# Altium schematic sheet STM32_MCU.SchDoc
size A4; SheetNumber: 3; SheetTotal: 5
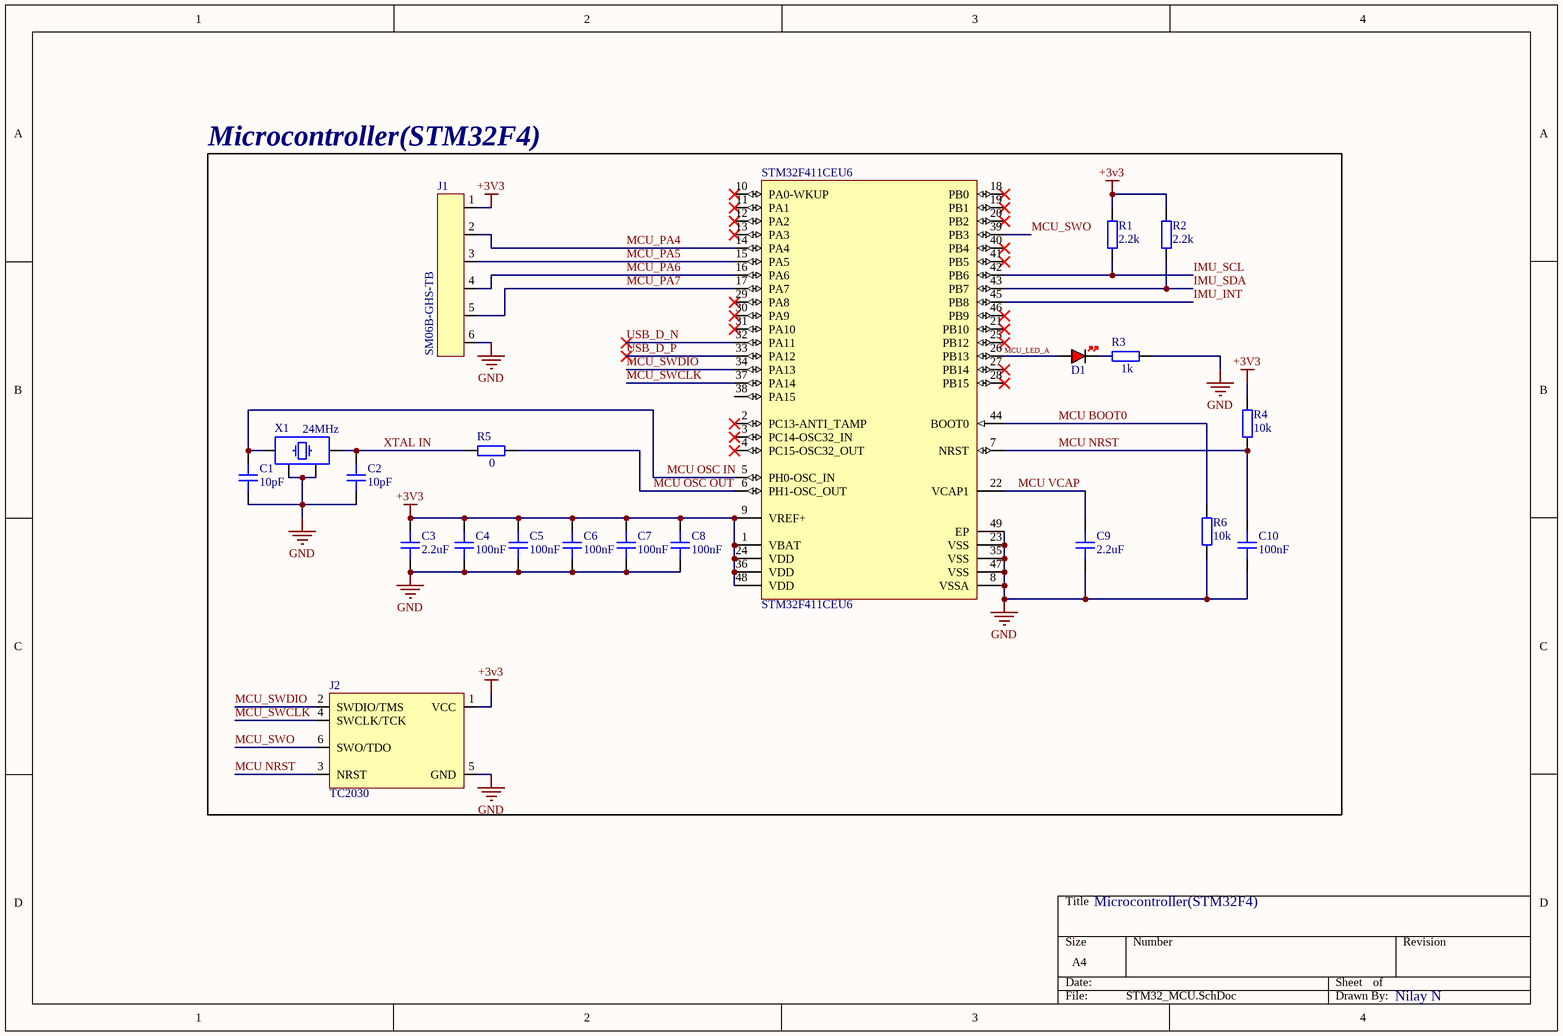
[diagram p0: STM32_MCU.SchDoc]

## Parts
C1  10pF  [CAP_0402]
C2  10pF  [CAP_0402]
C3  2.2uF  [CAP_0603]
C4  100nF  [CAP_0402]
C5  100nF  [CAP_0402]
C6  100nF  [CAP_0402]
C7  100nF  [CAP_0402]
C8  100nF  [CAP_0402]
C9  2.2uF  [CAP_0402]
C10  100nF  [CAP_0402]
D1  RED  [LED_0402_RED]  (value not drawn)
J1  SM06B-GHS-TB  [SM06B-GHS-TB]
J2  TC2030  [TC2030-FP]  (no BOM)
R1  2.2k  [RES_0402]
R2  2.2k  [RES_0402]
R3  1k  [RES_0402]
R4  10k  [RES_0402]
R5  0  [RES_0402]
R6  10k  [RES_0402]
STM32F411CEU6  STM32F411CEU6  [STM-UFQFPN48_L]
X1  24MHz  [XTAL_3225]

## Blocks framed on the sheet
Microcontroller(STM32F4): C1-C10 D1 J1 J2 R1-R6 STM32F411CEU6 X1

## Nets
+3V3: C3.2 C4.2 C5.2 C6.2 C7.2 C8.2 J1.1 J2.1(VCC) R1.2 R2.2 R4.2 STM32F411CEU6.1(VBAT) STM32F411CEU6.9(VREF+) STM32F411CEU6.24(VDD) STM32F411CEU6.36(VDD) STM32F411CEU6.48(VDD)
GND: C1.1 C2.1 C3.1 C4.1 C5.1 C6.1 C7.1 C8.1 C9.1 C10.1 J1.6 J2.5(GND) R3.1 R6.1 STM32F411CEU6.8(VSSA) STM32F411CEU6.23(VSS) STM32F411CEU6.35(VSS) STM32F411CEU6.47(VSS) STM32F411CEU6.49(EP) X1.2 X1.4
IMU_INT: STM32F411CEU6.45(PB8)
IMU_SCL: R1.1 STM32F411CEU6.42(PB6)
IMU_SDA: R2.1 STM32F411CEU6.43(PB7)
MCU BOOT0: R6.2 STM32F411CEU6.44(BOOT0)
MCU NRST: C10.2 J2.3(NRST) R4.1 STM32F411CEU6.7(NRST)
MCU OSC IN: C1.2 STM32F411CEU6.5(PH0-OSC_IN) X1.1
MCU OSC OUT: R5.2 STM32F411CEU6.6(PH1-OSC_OUT)
MCU VCAP: C9.2 STM32F411CEU6.22(VCAP1)
MCU_LED_A: D1.A STM32F411CEU6.26(PB13)
MCU_PA4: J1.2 STM32F411CEU6.14(PA4)
MCU_PA5: J1.3 STM32F411CEU6.15(PA5)
MCU_PA6: J1.4 STM32F411CEU6.16(PA6)
MCU_PA7: J1.5 STM32F411CEU6.17(PA7)
MCU_SWCLK: J2.4(SWCLK/TCK) STM32F411CEU6.37(PA14)
MCU_SWDIO: J2.2(SWDIO/TMS) STM32F411CEU6.34(PA13)
MCU_SWO: J2.6(SWO/TDO) STM32F411CEU6.39(PB3)
USB_D_N: STM32F411CEU6.32(PA11)
USB_D_P: STM32F411CEU6.33(PA12)
XTAL IN: C2.2 R5.1 X1.3
NetD1_K: D1.K R3.2

Not connected (* = marked no-connect by the designer): STM32F411CEU6 2(PC13-ANTI_TAMP)* 3(PC14-OSC32_IN)* 4(PC15-OSC32_OUT)* 10(PA0-WKUP)* 11(PA1)* 12(PA2)* 13(PA3)* 18(PB0)* 19(PB1)* 20(PB2)* 21(PB10)* 25(PB12)* 27(PB14)* 28(PB15)* 29(PA8)* 30(PA9)* 31(PA10)* 38(PA15) 40(PB4)* 41(PB5)* 46(PB9)*

## Notes on the sheet
- Microcontroller(STM32F4)
- Nilay N

## Library data of the parts
C1 C2 C4-C10 = CAP_0402: Capacitor SMD 0402; Manufacturer: *; Manufacturer Part Number: *; Distributor Link: *; LCSC: *; Rating: *; Dielectric: *
C3 = CAP_0603: Capacitor SMD 0603; Manufacturer: *; Manufacturer Part Number: *; Distributor Link: *; LCSC: *; Rating: *; Dielectric: *
D1 = LED_0402_RED: LED 0402 RED SMD
J1 = SM06B-GHS-TB: Header Connector 6 Position 1.25MM Pitch SMD Horizontal JST GH; Manufacturer: JST; Manufacturer Part Number: SM06B-GHS-TB
J2 = TC2030: Tag-Connect No-Solder SWD Debug Connector DO NOT PLACE; Manufacturer: Tag-Connect; Manufacturer Part Number: TC2030
R1-R6 = RES_0402: Resistor SMD 0402; Manufacturer: *; Manufacturer Part Number: *; Distributor Link: *; LCSC: *
STM32F411CEU6 = CMP-0243-00165-1: ARM Cortex-M4 32-bit MCU+FPU, 512 KB Flash, 128 KB RAM, 36 I/Os, 48-Pin UFQFPN, -40 to 85 degC, Tray; Operating Frequency(F) (Processor speed) (MHz): 100; FLASH Size (Prog) (kB): 512; Internal RAM Size (kB): 128; I/Os (High Current): 36; Supply Voltage(Vcc) min (V): 1.7; Package Reference: 48-Pin Ultra Thin Fine Pitch Quad Flat No-Lead, 7 x 7 x 0.6 mm Body, 0.5 mm Pitch, Exposed Pad; ComponentLink1Description: Manufacturer URL; ComponentLink1URL: http://www.st.com/; Packing: Tray; Package Description: UFQFPN48; Core: ARM Cortex-M4; ComponentLink2Description: Datasheet; ComponentLink2URL: http://www.st.com/st-web-ui/static/active/en/resource/technical/document/datasheet/DM00115249.pdf; DatasheetVersion: Rev. 6; Mounting Technology: Surface Mount
X1 = TSX-3225_24.0000MF15X-AC: Crystal SMD 24MHz 10PPM 7pF 3225; Manufacturer: Epson; Manufacturer Part Number: TSX-3225 24.0000MF15X-AC